# Altium project PCB_Project.PrjPcb
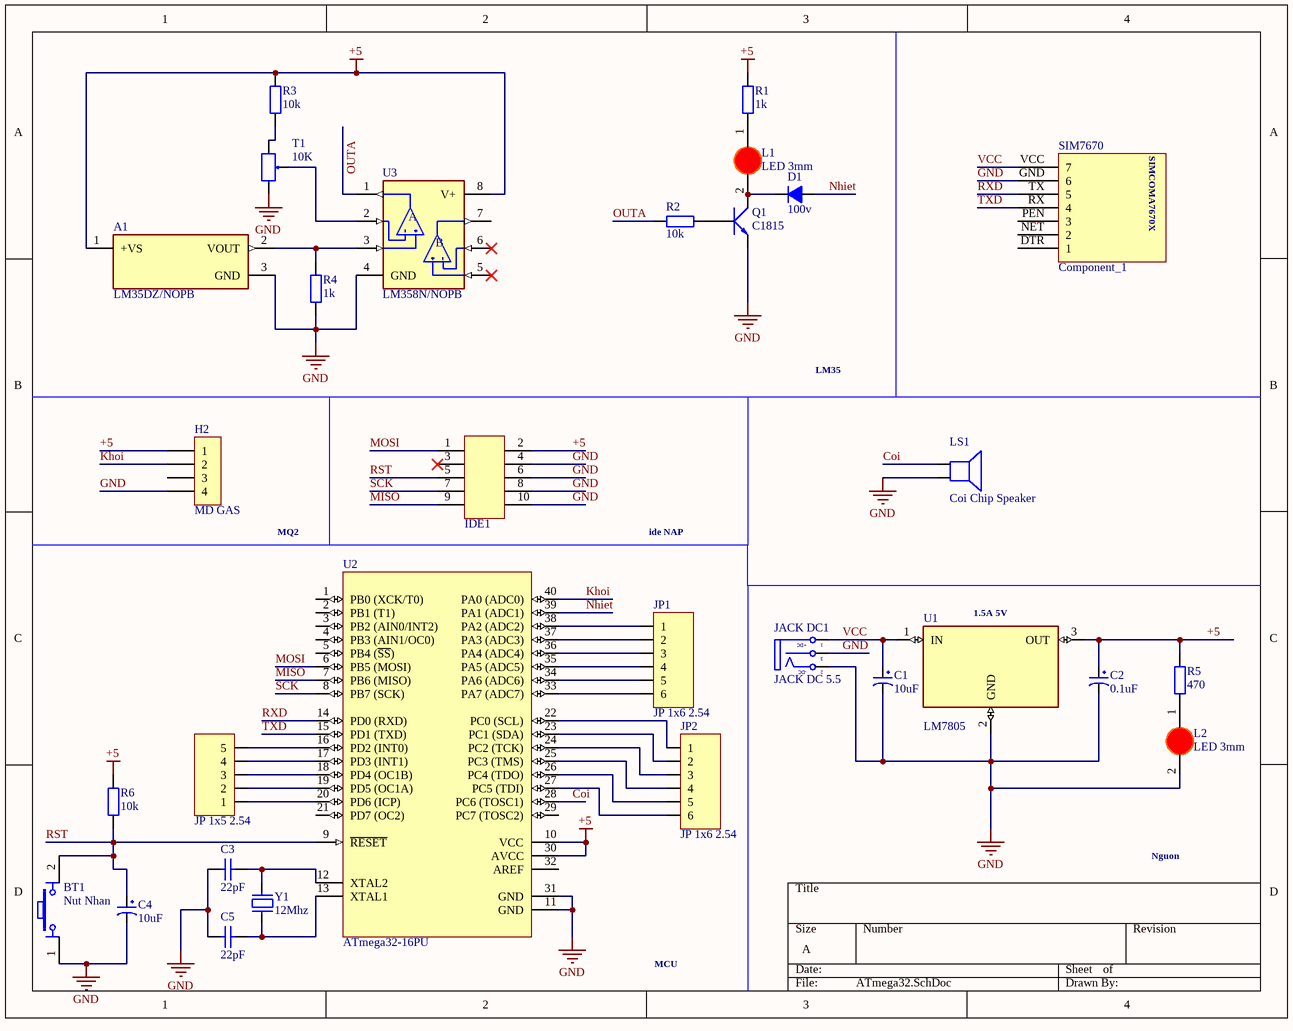
[diagram p0: ATmega32.SchDoc]
1 sheet, 30 parts. Net scope: global (net labels, ports and power ports of the same name join across sheets).
Board file: PCB11.PcbDoc

## Sheet ATmega32.SchDoc
size A; SheetNumber: 1; SheetTotal: 1

### Parts
A1  LM35DZ/NOPB  [TO92127P521H735-3]
BT1  Nut Nhan  [Nut Nhan 4 Chan Cam 6x6]
C1  10uF  [tu hoa 4mm]
C2  0.1uF  [tu hoa 4mm]
C3  22pF  [tu gom]
C4  10uF  [tu hoa 4mm]
C5  22pF  [tu gom]
D1  100v  [DIODE 1A]
H2  MD GAS  [Header 4P DC 2.54]
IDE1  IDE10  [IDE 10 DT]  (value not drawn)
JACK_DC1  JACK DC 5.5  [JACK DC 5.5]
JP1  JP 1x6 2.54  [JP 1x6 DT]
JP2  JP 1x6 2.54  [JP 1x6 DT]
JP3  JP 1x5 2.54  [JP 1x5 DT]
L1  LED 3mm  [LED-3MM-RED]
L2  LED 3mm  [LED-3MM-RED]
LS1  Coi Chip Speaker  [Coi Chip Speacker]
Q1  C1815  [TO92]
R1  1k  [tro vach 1/4w]
R2  10k  [tro vach 1/4w]
R3  10k  [tro vach 1/4w]
R4  1k  [tro vach 1/4w]
R5  470  [tro vach 1/4w]
R6  10k  [tro vach 1/4w]
SIM7670  Component_1  [SIM7670X]
T1  10K  [Bien Tro Vi Chinh Dung]
U1  LM7805  [TO255P1040X460X1968-3]
U2  ATmega32-16PU  [40P6]
U3  LM358N/NOPB  [DIP794W45P254L959H508Q8]
Y1  12Mhz  [Thach Anh 2 chan cam]

### Nets
+5: A1.1(+VS) C2.1 H2.1 IDE1.2 R1.2 R3.2 R5.2 R6.2 U1.3(OUT) U2.10(VCC) U2.30(AVCC) U3.8(V+)
GND: A1.3(GND) BT1.1 C1.2 C2.2 C3.2 C4.2 C5.2 H2.4 IDE1.4 IDE1.6 IDE1.8 IDE1.10 JACK_DC1.2(TN) JACK_DC1.3(S) L2.2(K) LS1.2 Q1.1(E) R4.1 SIM7670.GND(6) T1.3 U1.2(GND) U2.11(GND) U2.31(GND) U3.4(GND)
Coi: LS1.1 U2.28(PC6_(TOSC1))
Khoi: H2.2 U2.40(PA0_(ADC0))
MISO: IDE1.9 U2.7(PB6_(MISO))
MOSI: IDE1.1 U2.6(PB5_(MOSI))
Nhiet: D1.1(A) U2.39(PA1_(ADC1))
OUTA: R2.1 U3.1(OUTA)
RST: BT1.2 C4.1 IDE1.5 R6.1 U2.9(~{RESET})
RXD: SIM7670.TX(5) U2.14(PD0_(RXD))
SCK: IDE1.7 U2.8(PB7_(SCK))
TXD: SIM7670.RX(4) U2.15(PD1_(TXD))
VCC: C1.1 JACK_DC1.1(T) SIM7670.VCC(7) U1.1(IN)
NetA1_2: A1.2(VOUT) R4.2 U3.3(+INA)
NetC3_1: C3.1 U2.12(XTAL2) Y1.2
NetC5_1: C5.1 U2.13(XTAL1) Y1.1
NetD1_2: D1.2(K) L1.2(K) Q1.2(C)
NetJP1_1: JP1.1 U2.38(PA2_(ADC2))
NetJP1_2: JP1.2 U2.37(PA3_(ADC3))
NetJP1_3: JP1.3 U2.36(PA4_(ADC4))
NetJP1_4: JP1.4 U2.35(PA5_(ADC5))
NetJP1_5: JP1.5 U2.34(PA6_(ADC6))
NetJP1_6: JP1.6 U2.33(PA7_(ADC7))
NetJP2_1: JP2.1 U2.22(PC0_(SCL))
NetJP2_2: JP2.2 U2.23(PC1_(SDA))
NetJP2_3: JP2.3 U2.24(PC2_(TCK))
NetJP2_4: JP2.4 U2.25(PC3_(TMS))
NetJP2_5: JP2.5 U2.26(PC4_(TDO))
NetJP2_6: JP2.6 U2.27(PC5_(TDI))
NetJP3_1: JP3.1 U2.20(PD6_(ICP))
NetJP3_2: JP3.2 U2.19(PD5_(OC1A))
NetJP3_3: JP3.3 U2.18(PD4_(OC1B))
NetJP3_4: JP3.4 U2.17(PD3_(INT1))
NetJP3_5: JP3.5 U2.16(PD2_(INT0))
NetL1_1: L1.1(A) R1.1
NetL2_1: L2.1(A) R5.1
NetQ1_3: Q1.3(B) R2.2
NetR3_1: R3.1 T1.1
NetT1_2: T1.2 U3.2(-INA)

Not connected (* = marked no-connect by the designer): H2 3; IDE1 3*; SIM7670 DTR(1) NET(2) PEN(3); U2 1(PB0_(XCK/T0)) 2(PB1_(T1)) 3(PB2_(AIN0/INT2)) 4(PB3_(AIN1/OC0)) 5(PB4_(~{SS})) 21(PD7_(OC2)) 29(PC7_(TOSC2)) 32(AREF); U3 5(+INB)* 6(-INB)* 7(OUTB)

### Notes on the sheet
- LM35
- MQ2
- ide NAP
- (near U1) 1.5A 5V
- Nguon
- MCU
- (in symbol Component_1) SIMCOMA7670X
- (in symbol JACK DC 5.5) +DC; -DC
- (in symbol LM358N/NOPB) A; B

### Library data of the parts
BT1 = Nut Nhan 4 Chan Cam 6x6: Nut Nhan 4 Chan 6x6mm; Ten: Nút Nhấn 4 Chân 6x6x5MM DIP; Ma_Hang: MH004584
C1 C2 = Tu Hoa 2.2uF 50V 4x7: Cắm; Ten_Linh_Kien: Tụ Hóa 2.2uF 50V 4x7MM; Don_Vi: Con; So_Chan: 2; Ma_Hang: MH001356; Chung_Loai: Cắm; Kieu_Chan: *
C3 C5 = Tu gom 22pF 50V: Cắm; Don_Vi: Con; So_Chan: 2; Ten_Linh_Kien: Tụ gốm 22P 50V; Ma_Hang: MH004771; Chung_Loai: Cắm; Kieu_Chan: *
C4 = Tu Hoa 10uF 25V 4x7: Cắm; So_Chan: 2; Ten_Linh_Kien: Tụ Hóa 10uF 25V 4x7MM; Don_Vi: Con; Ma_Hang: MH001349; Chung_Loai: Cắm; Kieu_Chan: *
D1 = Diode 1N4007: Cắm; Ten_Linh_Kien: Diode 1N4007 1A (DIP); Don_Vi: Con; Ma_Hang: MH001063; Ghi Chu: *; Kieu_Chan: *; Chung_Loai: Cắm
H2 = Header 4P 2.54 Duc Cong: Cắm; Ten_Linh_Kien: Header 4P XH2.54-4P Đực Cong; Don_Vi: Con; Ma_Hang: MH001310; Chung_Loai: Cắm
IDE1 = IDE 10 DT
JACK_DC1 = JACK DC 5.5: Value: Jac DC
JP1 JP2 = JP 1x6 2.54 Duc Thang: Cắm; Ten_Linh_Kien: Jump Đơn Đực 2.54MM 1x40P Thẳng 11MM; Don_Vi: Con; Ma_Hang: MH000903; Ghi_Chu: *; Kieu_Chan: *; Chung_Loai: Cắm
JP3 = JP 1x5 2.54 Duc Thang: Cắm; Ten_Linh_Kien: Jump Đơn Đực 2.54MM 1x40P Thẳng 11MM; Don_Vi: Con; Ma_Hang: MH000903; Ghi_Chu: *; Kieu_Chan: *; Chung_Loai: Cắm
L1 L2 = LED 3mm Do: Cắm; Don_Vi: Con; Ma_Hang: MH003892; Ten_Linh_Kien: Led 3MM Phủ Đỏ (10c); Ghi_Chu: *; Kieu_Chan: *; Chung_Loai: Cắm
LS1 = Coi Chip Speaker: Còi chip
Q1 = C1815: NPN transistor; Value: C9014
R1-R3 R5 = Tro Vach 1/4W 5% 10k: Căm; Chung_Loai: Cắm; Don_Vi: Con; So_Chan: 2; Ten_Linh_Kien: Trở Vạch 1/4w 5% 10K; Ma_Hang: MH007354; Kieu_Chan: *
R4 R6 = Tro Vach 1/4W 5% 1k: Cắm; Don_Vi: Con; So_Chan: 2; Ten_Linh_Kien: Trở Vạch 1/4w 5% 1k; Ma_Hang: MH007390; Chung_Loai: Cắm; Kieu_Chan: *
T1 = Bien Tro Tinh Chinh 10K Dung: Cắm; Ma_Hang: MH003232; Ten_Linh_Kien: Biến Trở VR 103-10K 3296W; Don_Vi: Con; Kieu_Chan: *; Chung_Loai: Cắm; Ghi_Chu: *
U2 = ATMEGA32-16PU: 8-bit AVR Microcontroller, 4.5-5.5V, 16MHz, 32KB Flash, 1024 Bytes EEPROM, 2KB SRAM, 40-pin PDIP, Industrial Grade (-40°C to 85°C); ComponentLink1Description: Manufacturer URL; ComponentLink2Description: ATmega32(L) Datasheet; DatasheetVersion: revQ, Feb-2011; ComponentLink3URL: http://atmel.com/dyn/resources/prod_documents/2503S.pdf; ComponentLink3Description: ATmega32(L) Summary; ComponentLink1URL: http://www.atmel.com/; Code_JEDEC: MS-011-AC; PackageVersion: revB, Sep-2001; PackageDescription: 40-lead (0.600"/15.24mm Wide) Plastic Dual Inline Package (PDIP); ComponentLink2URL: http://atmel.com/dyn/resources/prod_documents/doc2503.pdf; PackageReference: 40P6; PartNumber: ATMEGA32-16PU
U3 = LM358N/NOPB: <a href="https://snapeda.com/parts/LM358N/NOPB/Texas%20Instruments/view-part/?ref=eda">Check prices</a>; Price: None; MP: LM358N/NOPB; Value: *; Availability: Unavailable; Package: None
Y1 = Thach Anh 2 chan Cam: Crystal For all Crystal 2pin.; Value: 4Mhz
A1 = LM35DZ/NOPB: Package: None; Price: None; Availability: Unavailable; MP: LM35DZ/NOPB; Value: *
U1 = LM7805: Package: None; Availability: Unavailable; Value: *; MP: LM7805; Price: None